# Altium schematic sheet BAT 80 LF105-12.SchDoc
size A3; SheetNumber: 1; SheetTotal: 1
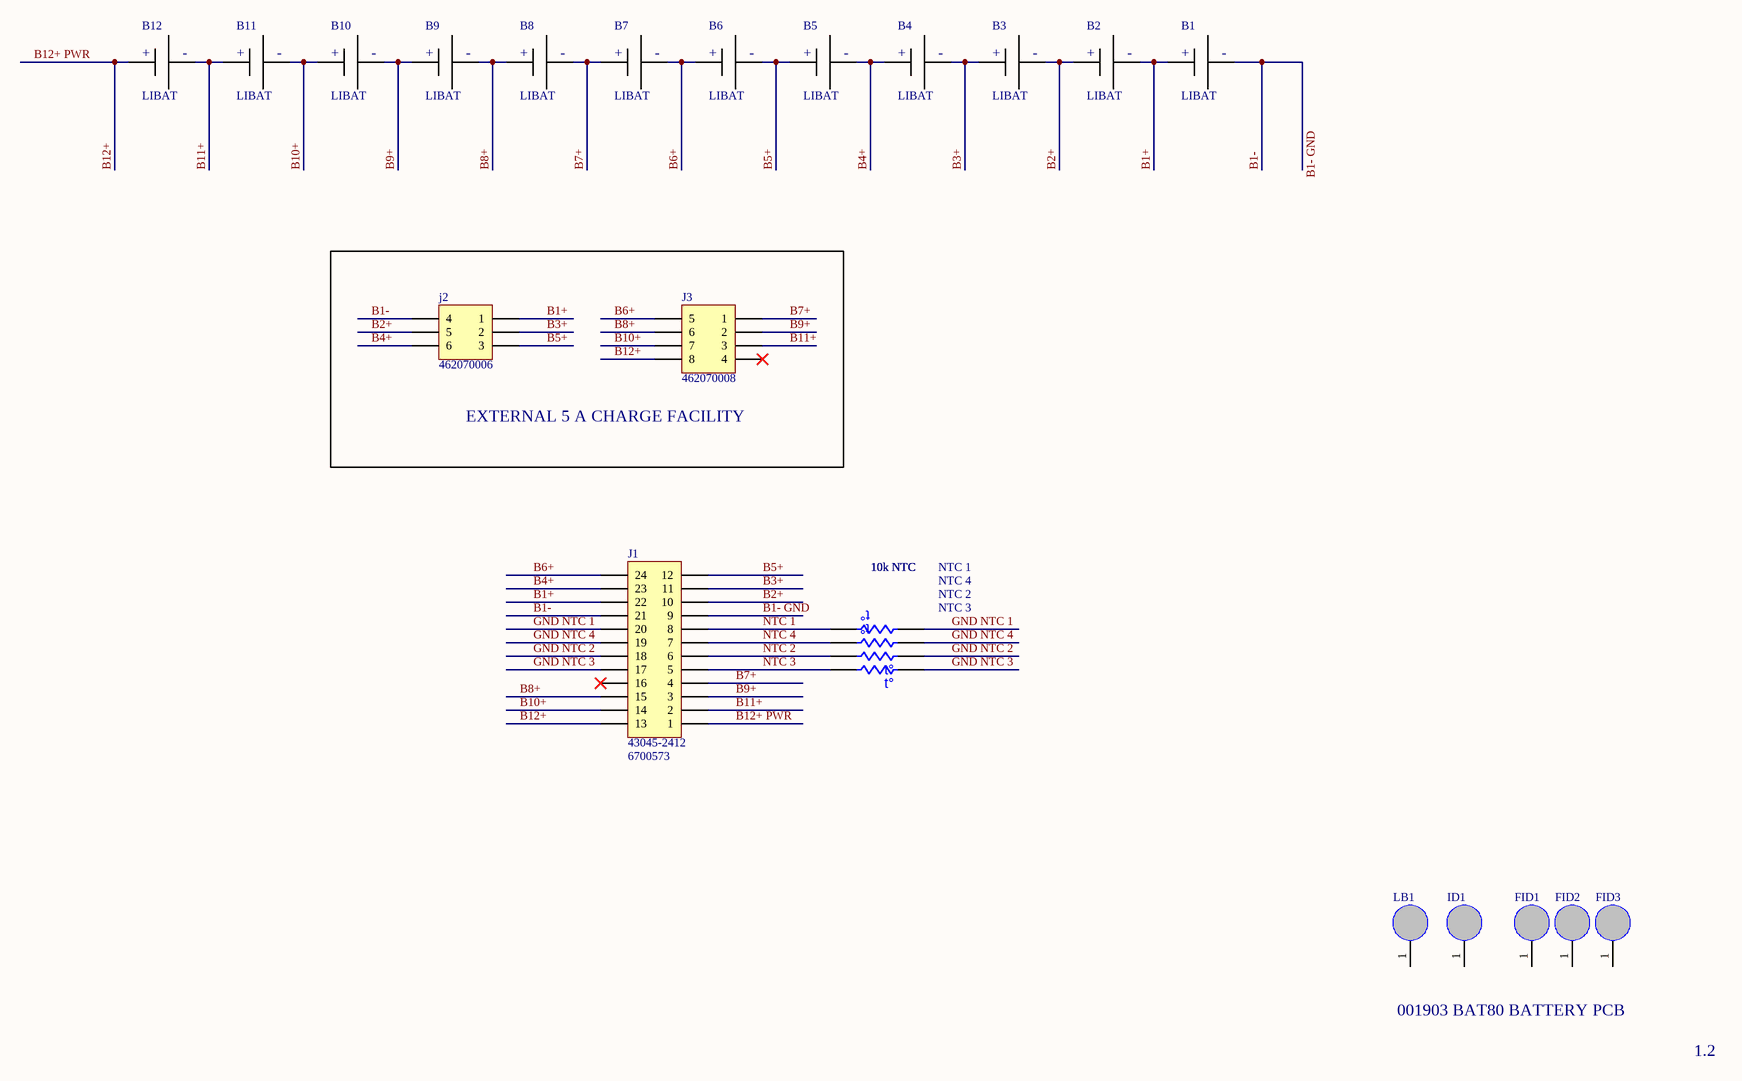
[diagram p0: BAT 80 LF105-12.SchDoc]

## Parts
B1  LIBAT  [LF105]
B2  LIBAT  [LF105]
B3  LIBAT  [LF105]
B4  LIBAT  [LF105]
B5  LIBAT  [LF105]
B6  LIBAT  [LF105]
B7  LIBAT  [LF105]
B8  LIBAT  [LF105]
B9  LIBAT  [LF105]
B10  LIBAT  [LF105]
B11  LIBAT  [LF105]
B12  LIBAT  [LF105]
FID1  PE PAD  [FIDUCIAL]  (value not drawn)
FID2  PE PAD  [FIDUCIAL]  (value not drawn)
FID3  PE PAD  [FIDUCIAL]  (value not drawn)
ID1  PE PAD  [QR-FRAME]  (value not drawn)
J1  43045-2412  Supplier Part Number 1: 6700573  [MICROFIT 24 VER]
j2  462070006  [MINIFIT JR 6 VER]
J3  462070008  [MINIFIT JR 8 VER]
LB1  PE PAD  [LAYERBOX-4]  (value not drawn)
NTC_1  10k NTC  [NTC0805-HC]
NTC_2  10k NTC  [NTC0805-HC]
NTC_3  10k NTC  [NTC0805-HC]
NTC_4  10k NTC  [NTC0805-HC]

## Blocks framed on the sheet
EXTERNAL 5 A CHARGE FACILITY: j2 J3

## Nets
B1+: B1.1 B2.2 J1.22 j2.1
B1-: B1.2 J1.9 J1.21 j2.4  [also labelled B1- GND]
B2+: B2.1 B3.2 J1.10 j2.5
B3+: B3.1 B4.2 J1.11 j2.2
B4+: B4.1 B5.2 J1.23 j2.6
B5+: B5.1 B6.2 J1.12 j2.3
B6+: B6.1 B7.2 J1.24 J3.5
B7+: B7.1 B8.2 J1.4 J3.1
B8+: B8.1 B9.2 J1.15 J3.6
B9+: B9.1 B10.2 J1.3 J3.2
B10+: B10.1 B11.2 J1.14 J3.7
B11+: B11.1 B12.2 J1.2 J3.3
B12+: B12.1 J1.1 J1.13 J3.8  [also labelled B12+ PWR]
GND NTC 1: J1.20 NTC_1.2
GND NTC 2: J1.18 NTC_2.1
GND NTC 3: J1.17 NTC_3.1
GND NTC 4: J1.19 NTC_4.2
NTC 1: J1.8 NTC_1.1
NTC 2: J1.6 NTC_2.2
NTC 3: J1.5 NTC_3.2
NTC 4: J1.7 NTC_4.1

Not connected (* = marked no-connect by the designer): FID1 1; FID2 1; FID3 1; ID1 1; J1 16*; J3 4*; LB1 1

## Notes on the sheet
- 001903 BAT80 BATTERY PCB
- 1.2
- (in symbol LI-BATTERY) +; -
- (in symbol Res Thermal) t°

## Library data of the parts
B1-B12 = LI-BATTERY: LF 105
J1 = Header 12X2A: MOLEX 43045-2412; LatestRevisionDate: 17-Jul-2002; LatestRevisionNote: Re-released for DXP Platform.; Publisher: Altium Limited; Supplier 1: RSComponents
j2 = Header 3X2A: MOLEX 46207-0006; LatestRevisionDate: 17-Jul-2002; LatestRevisionNote: Re-released for DXP Platform.; Publisher: Altium Limited
J3 = Header 4X2A: MOLEX  46207-0008; LatestRevisionDate: 17-Jul-2002; LatestRevisionNote: Re-released for DXP Platform.; Publisher: Altium Limited
NTC_1-NTC_4 = Res Thermal: Vishay NTCS0805E3103FLT; Published: 24-Mar-1999; LatestRevisionDate: 04-Mar-2005; LatestRevisionNote: PCB Footprint replaced.; PackageReference: 6-0805; Publisher: Altium Limited